# EAGLE schematic module (EAGLE 9.4.0)

## Sheet 1 of 5: Interconnect
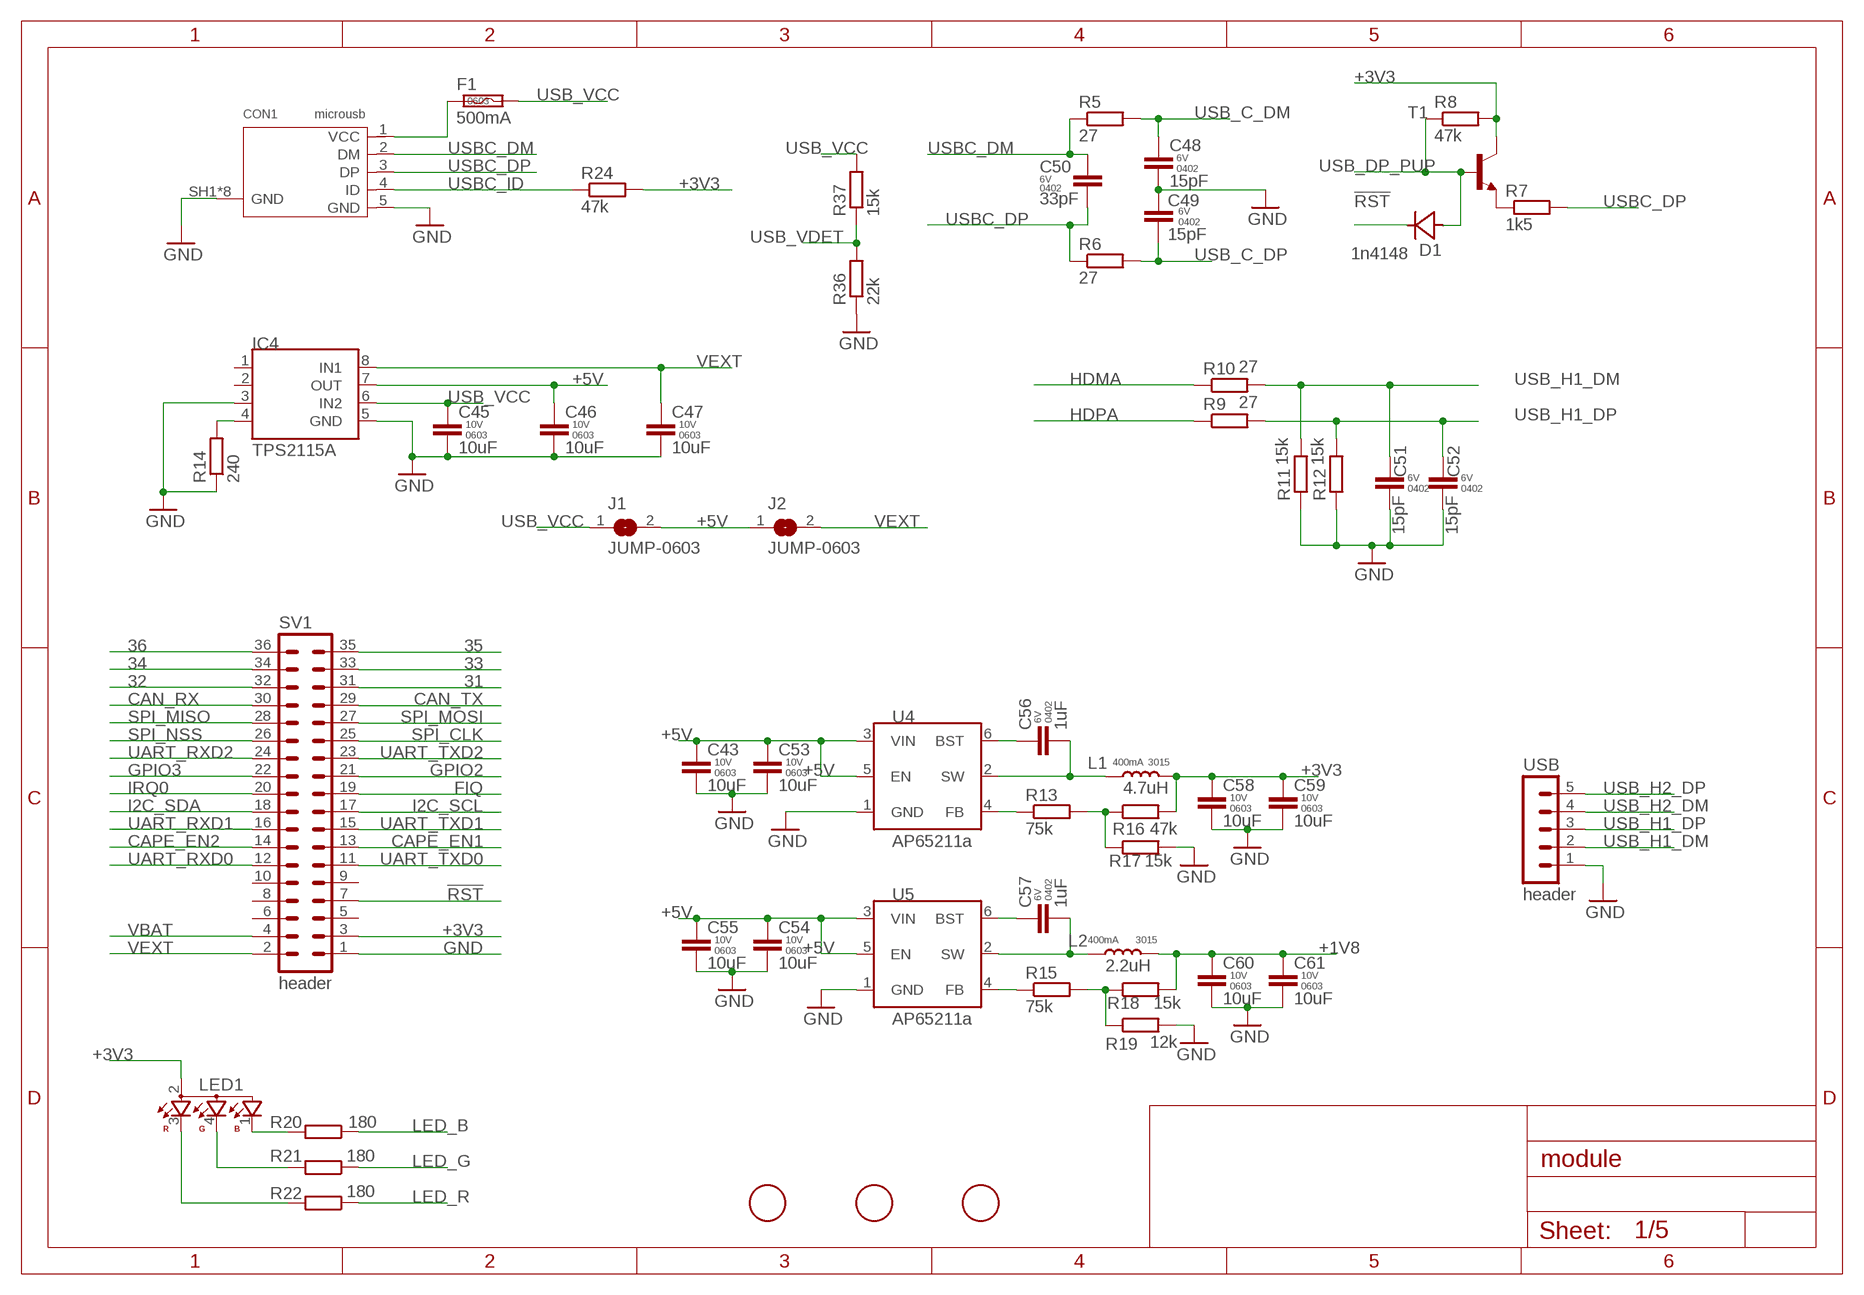
[diagram p0: schematic, sheet 1]

### Parts
C43  10uF  CAP-0603  [C0603]
C45  10uF  CAP-0603  [C0603]
C46  10uF  CAP-0603  [C0603]
C47  10uF  CAP-0603  [C0603]
C48  15pF  CAP-0402  [C0402K]
C49  15pF  CAP-0402  [C0402K]
C50  33pF  CAP-0402  [C0402K]
C51  15pF  CAP-0402  [C0402K]
C52  15pF  CAP-0402  [C0402K]
C53  10uF  CAP-0603  [C0603]
C54  10uF  CAP-0603  [C0603]
C55  10uF  CAP-0603  [C0603]
C56  1uF  CAP-0402  [C0402K]
C57  1uF  CAP-0402  [C0402K]
C58  10uF  CAP-0603  [C0603]
C59  10uF  CAP-0603  [C0603]
C60  10uF  CAP-0603  [C0603]
C61  10uF  CAP-0603  [C0603]
CON1  microusb  10118194-0001LF  [10118194]
D1  1n4148  1N4148WS  [SOD323]
F1  500mA  FUSE-PTC-0603  [F0603]
IC4  TPS2115A  [TSSOP8]
J1  JUMP-0603  [C0603]
J2  JUMP-0603  [C0603]
L1  4.7uH  DJNR3015  [L3230M]
L2  2.2uH  DJNR3015  [L3230M]
LED1  OSTB1204C1E  [321015RGB]
R5  27  R-EU_R0402  [R0402]
R6  27  R-EU_R0402  [R0402]
R7  1k5  R-EU_R0402  [R0402]
R8  47k  R-EU_R0402  [R0402]
R9  27  R-EU_R0402  [R0402]
R10  27  R-EU_R0402  [R0402]
R11  15k  R-EU_R0402  [R0402]
R12  15k  R-EU_R0402  [R0402]
R13  75k  R-EU_R0402  [R0402]
R14  240  R-EU_R0402  [R0402]
R15  75k  R-EU_R0402  [R0402]
R16  47k  R-EU_R0402  [R0402]
R17  15k  R-EU_R0402  [R0402]
R18  15k  R-EU_R0402  [R0402]
R19  12k  R-EU_R0402  [R0402]
R20  180  R-EU_R0402  [R0402]
R21  180  R-EU_R0402  [R0402]
R22  180  R-EU_R0402  [R0402]
R24  47k  R-EU_R0402  [R0402]
R36  22k  R-EU_R0402  [R0402]
R37  15k  R-EU_R0402  [R0402]
SV1  header  MA18-2  [MA18-2]
T1  MMBT2222ALT1-NPN-SOT23-BEC  [SOT23-BEC]
U4  AP65211A  AP65211  [SOT95P280X110-6]
U5  AP65211A  AP65211  [SOT95P280X110-6]
U$1  FIDUCIAL  [FIDUCIAL_1MM]
U$2  FIDUCIAL  [FIDUCIAL_1MM]
U$3  FIDUCIAL  [FIDUCIAL_1MM]
USB  header  MA05-1  [MA05-1]

### Nets
31: SV1.31 ; also sheet 2
32: SV1.32 ; also sheet 2
33: SV1.33 ; also sheet 2
34: SV1.34 ; also sheet 2
35: SV1.35 ; also sheet 2
36: SV1.36 ; also sheet 2
!RST: D1.K(C) SV1.7 ; also sheet 2
+1V8: C60.1 C61.1 L2.2 R18.2 ; also sheet 2
+3V3: C58.1 C59.1 L1.2 LED1.2 R8.2 R16.2 R24.2 SV1.3 T1.C ; also sheet 2,3,5
+5V: C43.1 C46.1 C53.1 C54.1 C55.1 IC4.7(OUT) J1.2 J2.1 U4.3(VIN) U4.5(EN) U5.3(VIN) U5.5(EN)
CAN_RX: SV1.30
CAN_TX: SV1.29
CAPE_EN1: SV1.13 ; also sheet 2
CAPE_EN2: SV1.14 ; also sheet 2
FIQ: SV1.19 ; also sheet 2
GND: C43.2 C45.2 C46.2 C47.2 C48.2 C49.2 C51.2 C52.2 C53.2 C54.2 C55.2 C58.2 C59.2 C60.2 C61.2 CON1.5(GND) CON1.SH1(GND) CON1.SH2(GND) CON1.SH3(GND) CON1.SH4(GND) CON1.SH5(GND) CON1.SH6(GND) CON1.SH7(GND) CON1.SH8(GND) IC4.3 IC4.5(GND) R11.1 R12.1 R14.1 R17.2 R19.2 R36.1 SV1.1 U4.1(GND) U5.1(GND) USB.1 ; also sheet 2,3,5
GPIO2: SV1.21 ; also sheet 2
GPIO3: SV1.22 ; also sheet 2
HDMA: R10.1 ; also sheet 2
HDPA: R9.1 ; also sheet 2
I2C_SCL: SV1.17 ; also sheet 2
I2C_SDA: SV1.18 ; also sheet 2
IRQ0: SV1.20 ; also sheet 2
LED_B: R20.1 ; also sheet 2
LED_G: R21.1 ; also sheet 2
LED_R: R22.1 ; also sheet 2
N$3: C56.2 L1.1 U4.2(SW)
N$4: CON1.1(VCC) F1.1
N$6: IC4.4 R14.2
N$8: C57.2 L2.1 U5.2(SW)
N$9: LED1.1 R20.2
N$10: C56.1 U4.6(BST)
N$11: C57.1 U5.6(BST)
N$14: LED1.4 R21.2
N$15: R15.1 U5.4(FB)
N$18: R7.1 T1.E
N$20: R13.1 U4.4(FB)
N$21: R15.2 R18.1 R19.1
N$22: R13.2 R16.1 R17.1
N$23: LED1.3 R22.2
SPI_CLK: SV1.25 ; also sheet 2
SPI_MISO: SV1.28 ; also sheet 2
SPI_MOSI: SV1.27 ; also sheet 2
SPI_NSS: SV1.26 ; also sheet 2
UART_RXD0: SV1.12 ; also sheet 2
UART_RXD1: SV1.16 ; also sheet 2
UART_RXD2: SV1.24 ; also sheet 2
UART_TXD0: SV1.11 ; also sheet 2
UART_TXD1: SV1.15 ; also sheet 2
UART_TXD2: SV1.23 ; also sheet 2
USB_C_DM: C48.1 R5.2 ; also sheet 2
USB_C_DP: C49.1 R6.2 ; also sheet 2
USB_DP_PUP: D1.A R8.1 T1.B ; also sheet 2
USB_H1_DM: C51.1 R10.2 R11.2 USB.2
USB_H1_DP: C52.1 R9.2 R12.2 USB.3
USB_H2_DM: USB.4
USB_H2_DP: USB.5
USB_VCC: C45.1 F1.2 IC4.6(IN2) J1.1 R37.2
USB_VDET: R36.2 R37.1 ; also sheet 2
USBC_DM: C50.1 CON1.2(DM) R5.1
USBC_DP: C50.2 CON1.3(DP) R6.1 R7.2
USBC_ID: CON1.4(ID) R24.1 ; also sheet 2
VBAT: SV1.4
VEXT: C47.1 IC4.8(IN1) J2.2 SV1.2
Unconnected: IC4.1 IC4.2 SV1.5 SV1.6 SV1.8 SV1.9 SV1.10

## Sheet 2 of 5: Processor
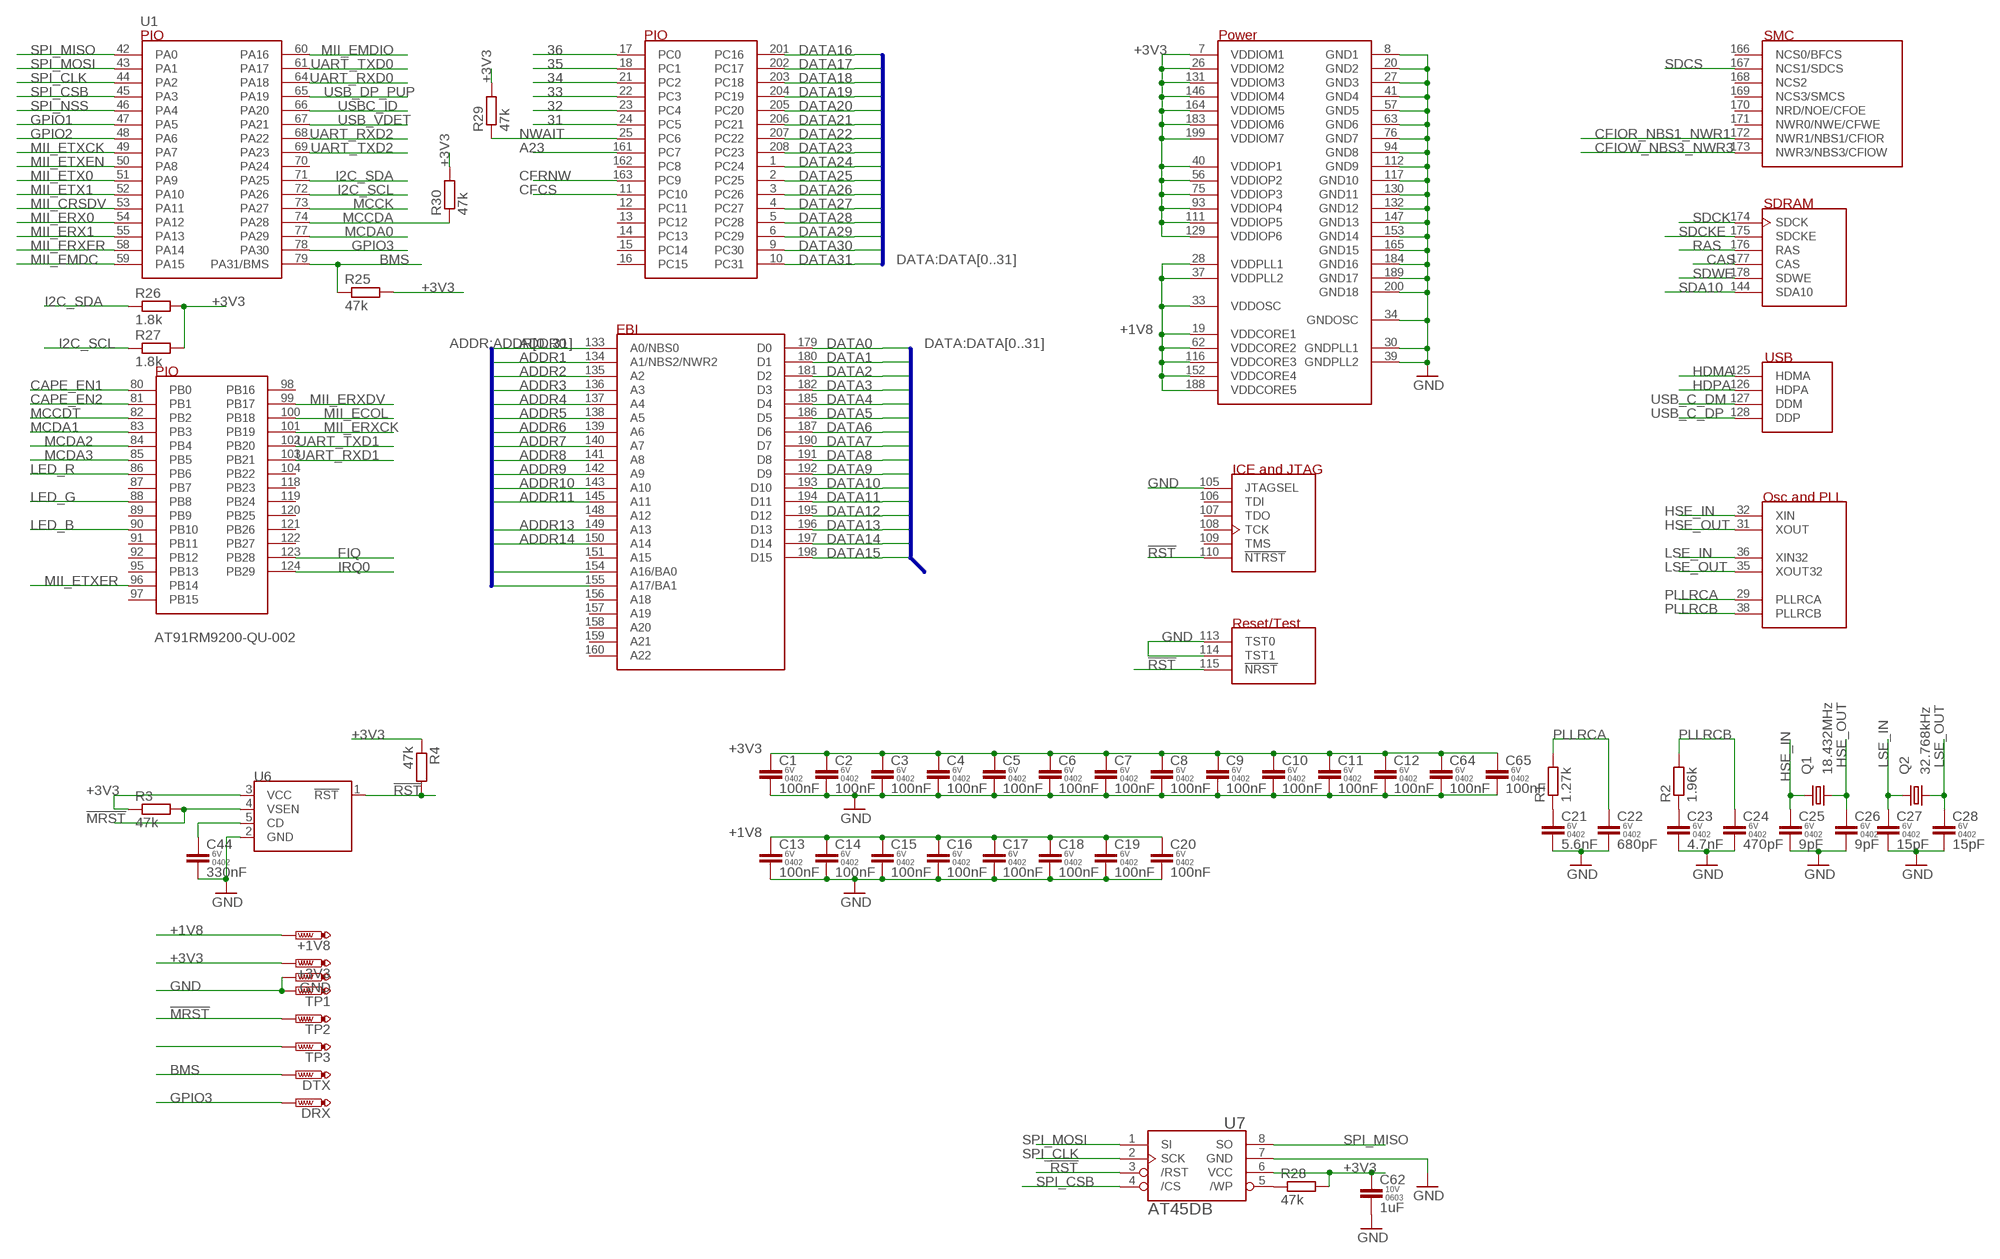
[diagram p1: schematic, sheet 2]

### Parts
+1V8  PTR1B1,27  [B1,27]
+3V3  PTR1B1,27  [B1,27]
C1  100nF  CAP-0402  [C0402K]
C2  100nF  CAP-0402  [C0402K]
C3  100nF  CAP-0402  [C0402K]
C4  100nF  CAP-0402  [C0402K]
C5  100nF  CAP-0402  [C0402K]
C6  100nF  CAP-0402  [C0402K]
C7  100nF  CAP-0402  [C0402K]
C8  100nF  CAP-0402  [C0402K]
C9  100nF  CAP-0402  [C0402K]
C10  100nF  CAP-0402  [C0402K]
C11  100nF  CAP-0402  [C0402K]
C12  100nF  CAP-0402  [C0402K]
C13  100nF  CAP-0402  [C0402K]
C14  100nF  CAP-0402  [C0402K]
C15  100nF  CAP-0402  [C0402K]
C16  100nF  CAP-0402  [C0402K]
C17  100nF  CAP-0402  [C0402K]
C18  100nF  CAP-0402  [C0402K]
C19  100nF  CAP-0402  [C0402K]
C20  100nF  CAP-0402  [C0402K]
C21  5.6nF  CAP-0402  [C0402K]
C22  680pF  CAP-0402  [C0402K]
C23  4.7nF  CAP-0402  [C0402K]
C24  470pF  CAP-0402  [C0402K]
C25  9pF  CAP-0402  [C0402K]
C26  9pF  CAP-0402  [C0402K]
C27  15pF  CAP-0402  [C0402K]
C28  15pF  CAP-0402  [C0402K]
C44  330nF  CAP-0402  [C0402K]
C62  1uF  CAP-0603  [C0603]
C64  100nF  CAP-0402  [C0402K]
C65  100nF  CAP-0402  [C0402K]
DRX  PTR1B1,27  [B1,27]
DTX  PTR1B1,27  [B1,27]
GND  PTR1B1,27  [B1,27]
Q1  18.432MHz  3215-7  [3215]
Q2  32.768kHz  CFPX–217-NHT  [3215]
R1  1.27k  R-EU_R0402  [R0402]
R2  1.96k  R-EU_R0402  [R0402]
R3  47k  R-EU_R0402  [R0402]
R4  47k  R-EU_R0402  [R0402]
R25  47k  R-EU_R0402  [R0402]
R26  1.8k  R-EU_R0402  [R0402]
R27  1.8k  R-EU_R0402  [R0402]
R28  47k  R-EU_R0402  [R0402]
R29  47k  R-EU_R0402  [R0402]
R30  47k  R-EU_R0402  [R0402]
TP1  PTR1B1,27  [B1,27]
TP2  PTR1B1,27  [B1,27]
TP3  PTR1B1,27  [B1,27]
U1  AT91RM9200-QU-002  [QFP50P3120X3120X410-208N]
U6  STM1831  [SOT95P280X100-5]
U7  AT45DB-S  [SO08-208]

### Nets
31: U1.24(PC5) ; also sheet 1
32: U1.23(PC4) ; also sheet 1
33: U1.22(PC3) ; also sheet 1
34: U1.21(PC2) ; also sheet 1
35: U1.18(PC1) ; also sheet 1
36: U1.17(PC0) ; also sheet 1
!MRST: R3.2 TP2.TP U6.4(VSEN)
!RST: R4.2 U1.110(!NTRST) U1.115(!NRST) U6.1(!RST) U7.3(/RST) ; also sheet 1
+1V8: +1V8.TP C13.1 C14.1 C15.1 C16.1 C17.1 C18.1 C19.1 C20.1 U1.19(VDDCORE1) U1.28(VDDPLL1) U1.33(VDDOSC) U1.37(VDDPLL2) U1.62(VDDCORE2) U1.116(VDDCORE3) U1.152(VDDCORE4) U1.188(VDDCORE5) ; also sheet 1
+3V3: +3V3.TP C1.1 C2.1 C3.1 C4.1 C5.1 C6.1 C7.1 C8.1 C9.1 C10.1 C11.1 C12.1 C62.1 C64.1 C65.1 R3.1 R4.1 R25.2 R26.2 R27.2 R28.2 R29.2 R30.2 U1.7(VDDIOM1) U1.26(VDDIOM2) U1.40(VDDIOP1) U1.56(VDDIOP2) U1.75(VDDIOP3) U1.93(VDDIOP4) U1.111(VDDIOP5) U1.129(VDDIOP6) U1.131(VDDIOM3) U1.146(VDDIOM4) U1.164(VDDIOM5) U1.183(VDDIOM6) U1.199(VDDIOM7) U6.3(VCC) U7.6(VCC) ; also sheet 1,3,5
A23: U1.161(PC7)
ADDR0: U1.133(A0/NBS0) ; also sheet 3
ADDR1: U1.134(A1/NBS2/NWR2) ; also sheet 3
ADDR2: U1.135(A2) ; also sheet 3
ADDR3: U1.136(A3) ; also sheet 3
ADDR4: U1.137(A4) ; also sheet 3
ADDR5: U1.138(A5) ; also sheet 3
ADDR6: U1.139(A6) ; also sheet 3
ADDR7: U1.140(A7) ; also sheet 3
ADDR8: U1.141(A8) ; also sheet 3
ADDR9: U1.142(A9) ; also sheet 3
ADDR10: U1.143(A10) ; also sheet 3
ADDR11: U1.145(A11) ; also sheet 3
ADDR13: U1.149(A13) ; also sheet 3
ADDR14: U1.150(A14) ; also sheet 3
ADDR16: U1.154(A16/BA0) ; also sheet 3
ADDR17: U1.155(A17/BA1) ; also sheet 3
BMS: DTX.TP R25.1 U1.79(PA31/BMS)
CAPE_EN1: U1.80(PB0) ; also sheet 1
CAPE_EN2: U1.81(PB1) ; also sheet 1
CAS: U1.177(CAS) ; also sheet 3
CFCS: U1.11(PC10)
CFIOR_NBS1_NWR1: U1.172(NWR1/NBS1/CFIOR) ; also sheet 3
CFIOW_NBS3_NWR3: U1.173(NWR3/NBS3/CFIOW) ; also sheet 3
CFRNW: U1.163(PC9)
DATA0: U1.179(D0) ; also sheet 3
DATA1: U1.180(D1) ; also sheet 3
DATA2: U1.181(D2) ; also sheet 3
DATA3: U1.182(D3) ; also sheet 3
DATA4: U1.185(D4) ; also sheet 3
DATA5: U1.186(D5) ; also sheet 3
DATA6: U1.187(D6) ; also sheet 3
DATA7: U1.190(D7) ; also sheet 3
DATA8: U1.191(D8) ; also sheet 3
DATA9: U1.192(D9) ; also sheet 3
DATA10: U1.193(D10) ; also sheet 3
DATA11: U1.194(D11) ; also sheet 3
DATA12: U1.195(D12) ; also sheet 3
DATA13: U1.196(D13) ; also sheet 3
DATA14: U1.197(D14) ; also sheet 3
DATA15: U1.198(D15) ; also sheet 3
DATA16: U1.201(PC16) ; also sheet 3
DATA17: U1.202(PC17) ; also sheet 3
DATA18: U1.203(PC18) ; also sheet 3
DATA19: U1.204(PC19) ; also sheet 3
DATA20: U1.205(PC20) ; also sheet 3
DATA21: U1.206(PC21) ; also sheet 3
DATA22: U1.207(PC22) ; also sheet 3
DATA23: U1.208(PC23) ; also sheet 3
DATA24: U1.1(PC24) ; also sheet 3
DATA25: U1.2(PC25) ; also sheet 3
DATA26: U1.3(PC26) ; also sheet 3
DATA27: U1.4(PC27) ; also sheet 3
DATA28: U1.5(PC28) ; also sheet 3
DATA29: U1.6(PC29) ; also sheet 3
DATA30: U1.9(PC30) ; also sheet 3
DATA31: U1.10(PC31) ; also sheet 3
FIQ: U1.123(PB28) ; also sheet 1
GND: C1.2 C2.2 C3.2 C4.2 C5.2 C6.2 C7.2 C8.2 C9.2 C10.2 C11.2 C12.2 C13.2 C14.2 C15.2 C16.2 C17.2 C18.2 C19.2 C20.2 C21.2 C22.2 C23.2 C24.2 C25.2 C26.2 C27.2 C28.2 C44.2 C62.2 C64.2 C65.2 GND.TP TP1.TP U1.8(GND1) U1.20(GND2) U1.27(GND3) U1.30(GNDPLL1) U1.34(GNDOSC) U1.39(GNDPLL2) U1.41(GND4) U1.57(GND5) U1.63(GND6) U1.76(GND7) U1.94(GND8) U1.105(JTAGSEL) U1.112(GND9) U1.113(TST0) U1.114(TST1) U1.117(GND10) U1.130(GND11) U1.132(GND12) U1.147(GND13) U1.153(GND14) U1.165(GND15) U1.184(GND16) U1.189(GND17) U1.200(GND18) U6.2(GND) U7.7(GND) ; also sheet 1,3,5
GPIO1: U1.47(PA5)
GPIO2: U1.48(PA6) ; also sheet 1
GPIO3: DRX.TP U1.78(PA30) ; also sheet 1
HDMA: U1.125(HDMA) ; also sheet 1
HDPA: U1.126(HDPA) ; also sheet 1
HSE_IN: C25.1 Q1.1 U1.32(XIN)
HSE_OUT: C26.1 Q1.3 U1.31(XOUT)
I2C_SCL: R27.1 U1.72(PA26) ; also sheet 1
I2C_SDA: R26.1 U1.71(PA25) ; also sheet 1
IRQ0: U1.124(PB29) ; also sheet 1
LED_B: U1.90(PB10) ; also sheet 1
LED_G: U1.88(PB8) ; also sheet 1
LED_R: U1.86(PB6) ; also sheet 1
LSE_IN: C27.1 Q2.1 U1.36(XIN32)
LSE_OUT: C28.1 Q2.2 U1.35(XOUT32)
MCCDA: R30.1 U1.74(PA28) ; also sheet 5
MCCDT: U1.82(PB2) ; also sheet 5
MCCK: U1.73(PA27) ; also sheet 5
MCDA0: U1.77(PA29) ; also sheet 5
MCDA1: U1.83(PB3) ; also sheet 5
MCDA2: U1.84(PB4) ; also sheet 5
MCDA3: U1.85(PB5) ; also sheet 5
MII_CRSDV: U1.53(PA11) ; also sheet 4
MII_ECOL: U1.100(PB18)
MII_EMDC: U1.59(PA15) ; also sheet 4
MII_EMDIO: U1.60(PA16) ; also sheet 4
MII_ERX0: U1.54(PA12) ; also sheet 4
MII_ERX1: U1.55(PA13) ; also sheet 4
MII_ERXCK: U1.101(PB19)
MII_ERXDV: U1.99(PB17)
MII_ERXER: U1.58(PA14) ; also sheet 4
MII_ETX0: U1.51(PA9) ; also sheet 4
MII_ETX1: U1.52(PA10) ; also sheet 4
MII_ETXCK: U1.49(PA7) ; also sheet 4
MII_ETXEN: U1.50(PA8) ; also sheet 4
MII_ETXER: U1.96(PB14)
N$1: C21.1 R1.1
N$2: C23.1 R2.1
N$5: R28.1 U7.5(/WP)
N$12: TP3.TP
N$17: C44.1 U6.5(CD)
NWAIT: R29.1 U1.25(PC6)
PLLRCA: C22.1 R1.2 U1.29(PLLRCA)
PLLRCB: C24.1 R2.2 U1.38(PLLRCB)
RAS: U1.176(RAS) ; also sheet 3
SDA10: U1.144(SDA10) ; also sheet 3
SDCK: U1.174(SDCK) ; also sheet 3
SDCKE: U1.175(SDCKE) ; also sheet 3
SDCS: U1.167(NCS1/SDCS) ; also sheet 3
SDWE: U1.178(SDWE) ; also sheet 3
SPI_CLK: U1.44(PA2) U7.2(SCK) ; also sheet 1
SPI_CSB: U1.45(PA3) U7.4(/CS)
SPI_MISO: U1.42(PA0) U7.8(SO) ; also sheet 1
SPI_MOSI: U1.43(PA1) U7.1(SI) ; also sheet 1
SPI_NSS: U1.46(PA4) ; also sheet 1
UART_RXD0: U1.64(PA18) ; also sheet 1
UART_RXD1: U1.103(PB21) ; also sheet 1
UART_RXD2: U1.68(PA22) ; also sheet 1
UART_TXD0: U1.61(PA17) ; also sheet 1
UART_TXD1: U1.102(PB20) ; also sheet 1
UART_TXD2: U1.69(PA23) ; also sheet 1
USB_C_DM: U1.127(DDM) ; also sheet 1
USB_C_DP: U1.128(DDP) ; also sheet 1
USB_DP_PUP: U1.65(PA19) ; also sheet 1
USB_VDET: U1.67(PA21) ; also sheet 1
USBC_ID: U1.66(PA20) ; also sheet 1
Unconnected: U1.12(PC11) U1.13(PC12) U1.14(PC13) U1.15(PC14) U1.16(PC15) U1.70(PA24) U1.87(PB7) U1.89(PB9) U1.91(PB11) U1.92(PB12) U1.95(PB13) U1.97(PB15) U1.98(PB16) U1.104(PB22) U1.106(TDI) U1.107(TDO) U1.108(TCK) U1.109(TMS) U1.118(PB23) U1.119(PB24) U1.120(PB25) U1.121(PB26) U1.122(PB27) U1.148(A12) U1.151(A15) U1.156(A18) U1.157(A19) U1.158(A20) U1.159(A21) U1.160(A22) U1.162(PC8) U1.166(NCS0/BFCS) U1.168(NCS2) U1.169(NCS3/SMCS) U1.170(NRD/NOE/CFOE) U1.171(NWR0/NWE/CFWE)

### Buses
ADDR:ADDR[0..31]
DATA:DATA[0..31]

## Sheet 3 of 5: SDRAM
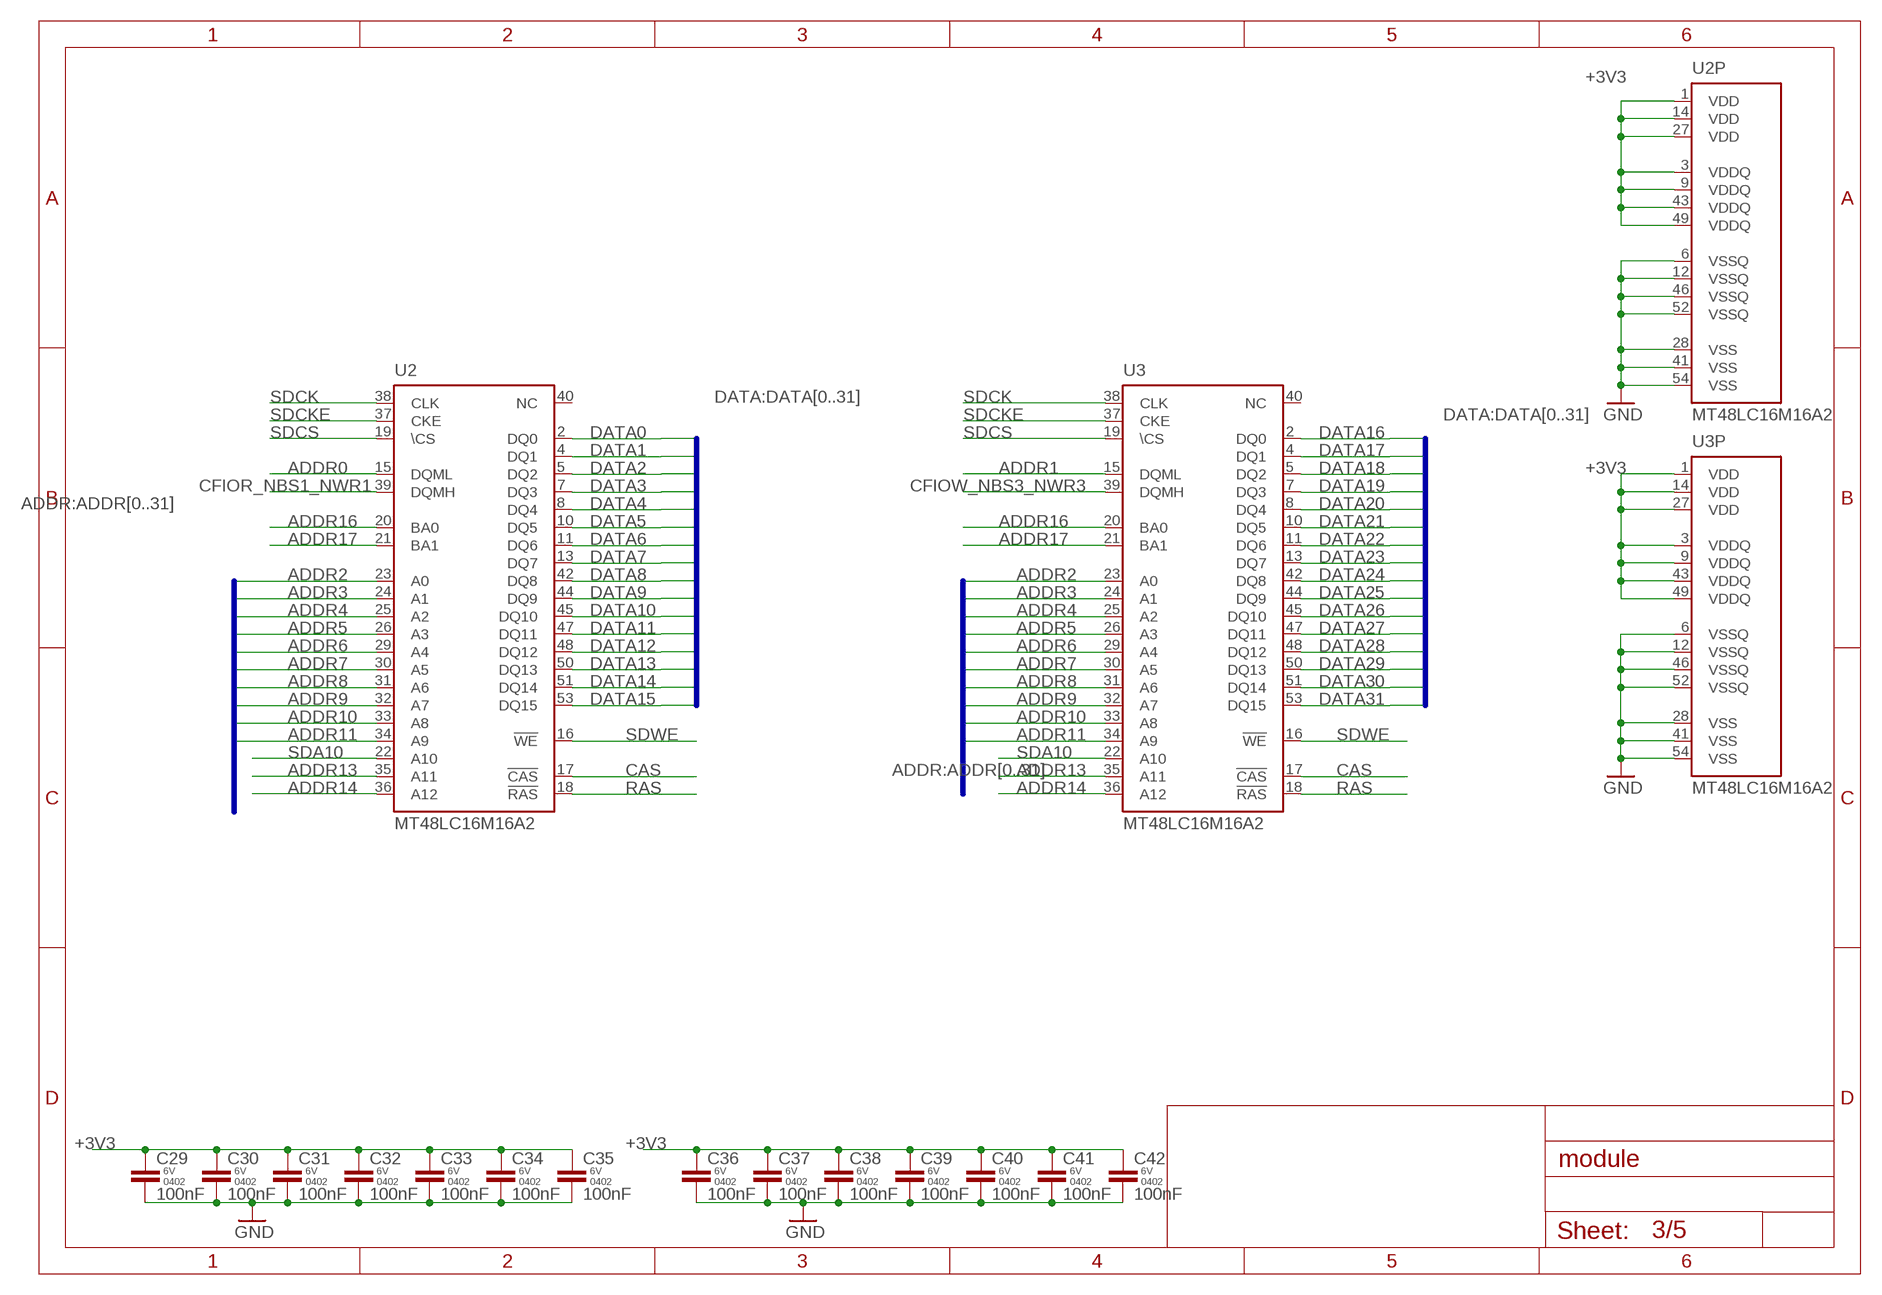
[diagram p2: schematic, sheet 3]

### Parts
C29  100nF  CAP-0402  [C0402K]
C30  100nF  CAP-0402  [C0402K]
C31  100nF  CAP-0402  [C0402K]
C32  100nF  CAP-0402  [C0402K]
C33  100nF  CAP-0402  [C0402K]
C34  100nF  CAP-0402  [C0402K]
C35  100nF  CAP-0402  [C0402K]
C36  100nF  CAP-0402  [C0402K]
C37  100nF  CAP-0402  [C0402K]
C38  100nF  CAP-0402  [C0402K]
C39  100nF  CAP-0402  [C0402K]
C40  100nF  CAP-0402  [C0402K]
C41  100nF  CAP-0402  [C0402K]
C42  100nF  CAP-0402  [C0402K]
U2  MT48LC16M16A2  [TSOP54-400]
U3  MT48LC16M16A2  [TSOP54-400]

### Nets
+3V3: C29.1 C30.1 C31.1 C32.1 C33.1 C34.1 C35.1 C36.1 C37.1 C38.1 C39.1 C40.1 C41.1 C42.1 U2.1(VDD) U2.3(VDDQ) U2.9(VDDQ) U2.14(VDD) U2.27(VDD) U2.43(VDDQ) U2.49(VDDQ) U3.1(VDD) U3.3(VDDQ) U3.9(VDDQ) U3.14(VDD) U3.27(VDD) U3.43(VDDQ) U3.49(VDDQ) ; also sheet 1,2,5
ADDR0: U2.15(DQML) ; also sheet 2
ADDR1: U3.15(DQML) ; also sheet 2
ADDR2: U2.23(A0) U3.23(A0) ; also sheet 2
ADDR3: U2.24(A1) U3.24(A1) ; also sheet 2
ADDR4: U2.25(A2) U3.25(A2) ; also sheet 2
ADDR5: U2.26(A3) U3.26(A3) ; also sheet 2
ADDR6: U2.29(A4) U3.29(A4) ; also sheet 2
ADDR7: U2.30(A5) U3.30(A5) ; also sheet 2
ADDR8: U2.31(A6) U3.31(A6) ; also sheet 2
ADDR9: U2.32(A7) U3.32(A7) ; also sheet 2
ADDR10: U2.33(A8) U3.33(A8) ; also sheet 2
ADDR11: U2.34(A9) U3.34(A9) ; also sheet 2
ADDR13: U2.35(A11) U3.35(A11) ; also sheet 2
ADDR14: U2.36(A12) U3.36(A12) ; also sheet 2
ADDR16: U2.20(BA0) U3.20(BA0) ; also sheet 2
ADDR17: U2.21(BA1) U3.21(BA1) ; also sheet 2
CAS: U2.17(!CAS) U3.17(!CAS) ; also sheet 2
CFIOR_NBS1_NWR1: U2.39(DQMH) ; also sheet 2
CFIOW_NBS3_NWR3: U3.39(DQMH) ; also sheet 2
DATA0: U2.2(DQ0) ; also sheet 2
DATA1: U2.4(DQ1) ; also sheet 2
DATA2: U2.5(DQ2) ; also sheet 2
DATA3: U2.7(DQ3) ; also sheet 2
DATA4: U2.8(DQ4) ; also sheet 2
DATA5: U2.10(DQ5) ; also sheet 2
DATA6: U2.11(DQ6) ; also sheet 2
DATA7: U2.13(DQ7) ; also sheet 2
DATA8: U2.42(DQ8) ; also sheet 2
DATA9: U2.44(DQ9) ; also sheet 2
DATA10: U2.45(DQ10) ; also sheet 2
DATA11: U2.47(DQ11) ; also sheet 2
DATA12: U2.48(DQ12) ; also sheet 2
DATA13: U2.50(DQ13) ; also sheet 2
DATA14: U2.51(DQ14) ; also sheet 2
DATA15: U2.53(DQ15) ; also sheet 2
DATA16: U3.2(DQ0) ; also sheet 2
DATA17: U3.4(DQ1) ; also sheet 2
DATA18: U3.5(DQ2) ; also sheet 2
DATA19: U3.7(DQ3) ; also sheet 2
DATA20: U3.8(DQ4) ; also sheet 2
DATA21: U3.10(DQ5) ; also sheet 2
DATA22: U3.11(DQ6) ; also sheet 2
DATA23: U3.13(DQ7) ; also sheet 2
DATA24: U3.42(DQ8) ; also sheet 2
DATA25: U3.44(DQ9) ; also sheet 2
DATA26: U3.45(DQ10) ; also sheet 2
DATA27: U3.47(DQ11) ; also sheet 2
DATA28: U3.48(DQ12) ; also sheet 2
DATA29: U3.50(DQ13) ; also sheet 2
DATA30: U3.51(DQ14) ; also sheet 2
DATA31: U3.53(DQ15) ; also sheet 2
GND: C29.2 C30.2 C31.2 C32.2 C33.2 C34.2 C35.2 C36.2 C37.2 C38.2 C39.2 C40.2 C41.2 C42.2 U2.6(VSSQ) U2.12(VSSQ) U2.28(VSS) U2.41(VSS) U2.46(VSSQ) U2.52(VSSQ) U2.54(VSS) U3.6(VSSQ) U3.12(VSSQ) U3.28(VSS) U3.41(VSS) U3.46(VSSQ) U3.52(VSSQ) U3.54(VSS) ; also sheet 1,2,5
RAS: U2.18(!RAS) U3.18(!RAS) ; also sheet 2
SDA10: U2.22(A10) U3.22(A10) ; also sheet 2
SDCK: U2.38(CLK) U3.38(CLK) ; also sheet 2
SDCKE: U2.37(CKE) U3.37(CKE) ; also sheet 2
SDCS: U2.19(\CS) U3.19(\CS) ; also sheet 2
SDWE: U2.16(!WE) U3.16(!WE) ; also sheet 2
Unconnected: U2.40(NC) U3.40(NC)

### Buses
DATA:DATA[0..31]
ADDR:ADDR[0..31]

## Sheet 4 of 5: Ethernet
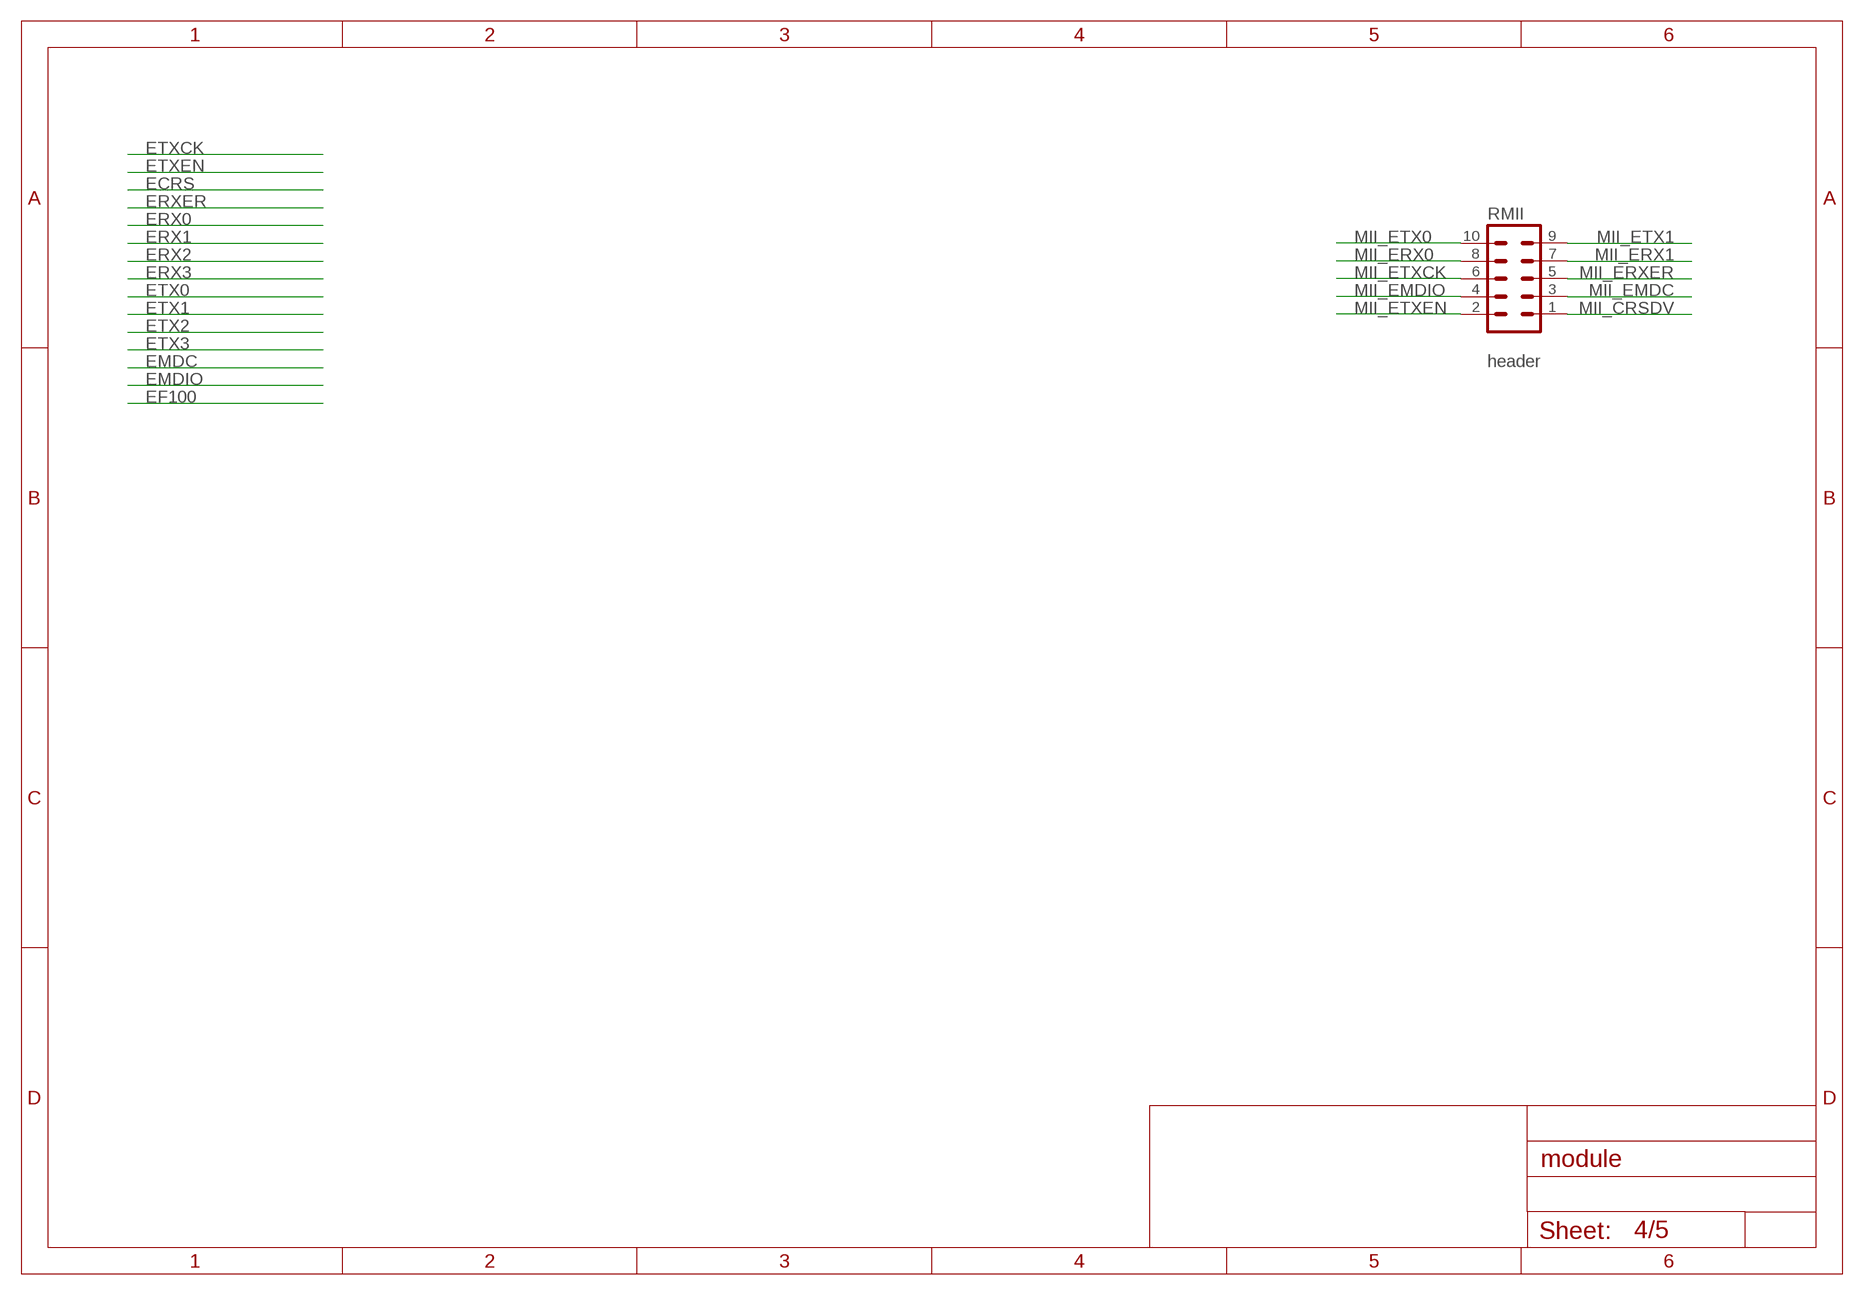
[diagram p3: schematic, sheet 4]

### Parts
RMII  header  MA05-2  [MA05-2]

### Nets
MII_CRSDV: RMII.1 ; also sheet 2
MII_EMDC: RMII.3 ; also sheet 2
MII_EMDIO: RMII.4 ; also sheet 2
MII_ERX0: RMII.8 ; also sheet 2
MII_ERX1: RMII.7 ; also sheet 2
MII_ERXER: RMII.5 ; also sheet 2
MII_ETX0: RMII.10 ; also sheet 2
MII_ETX1: RMII.9 ; also sheet 2
MII_ETXCK: RMII.6 ; also sheet 2
MII_ETXEN: RMII.2 ; also sheet 2

## Sheet 5 of 5: SD Card
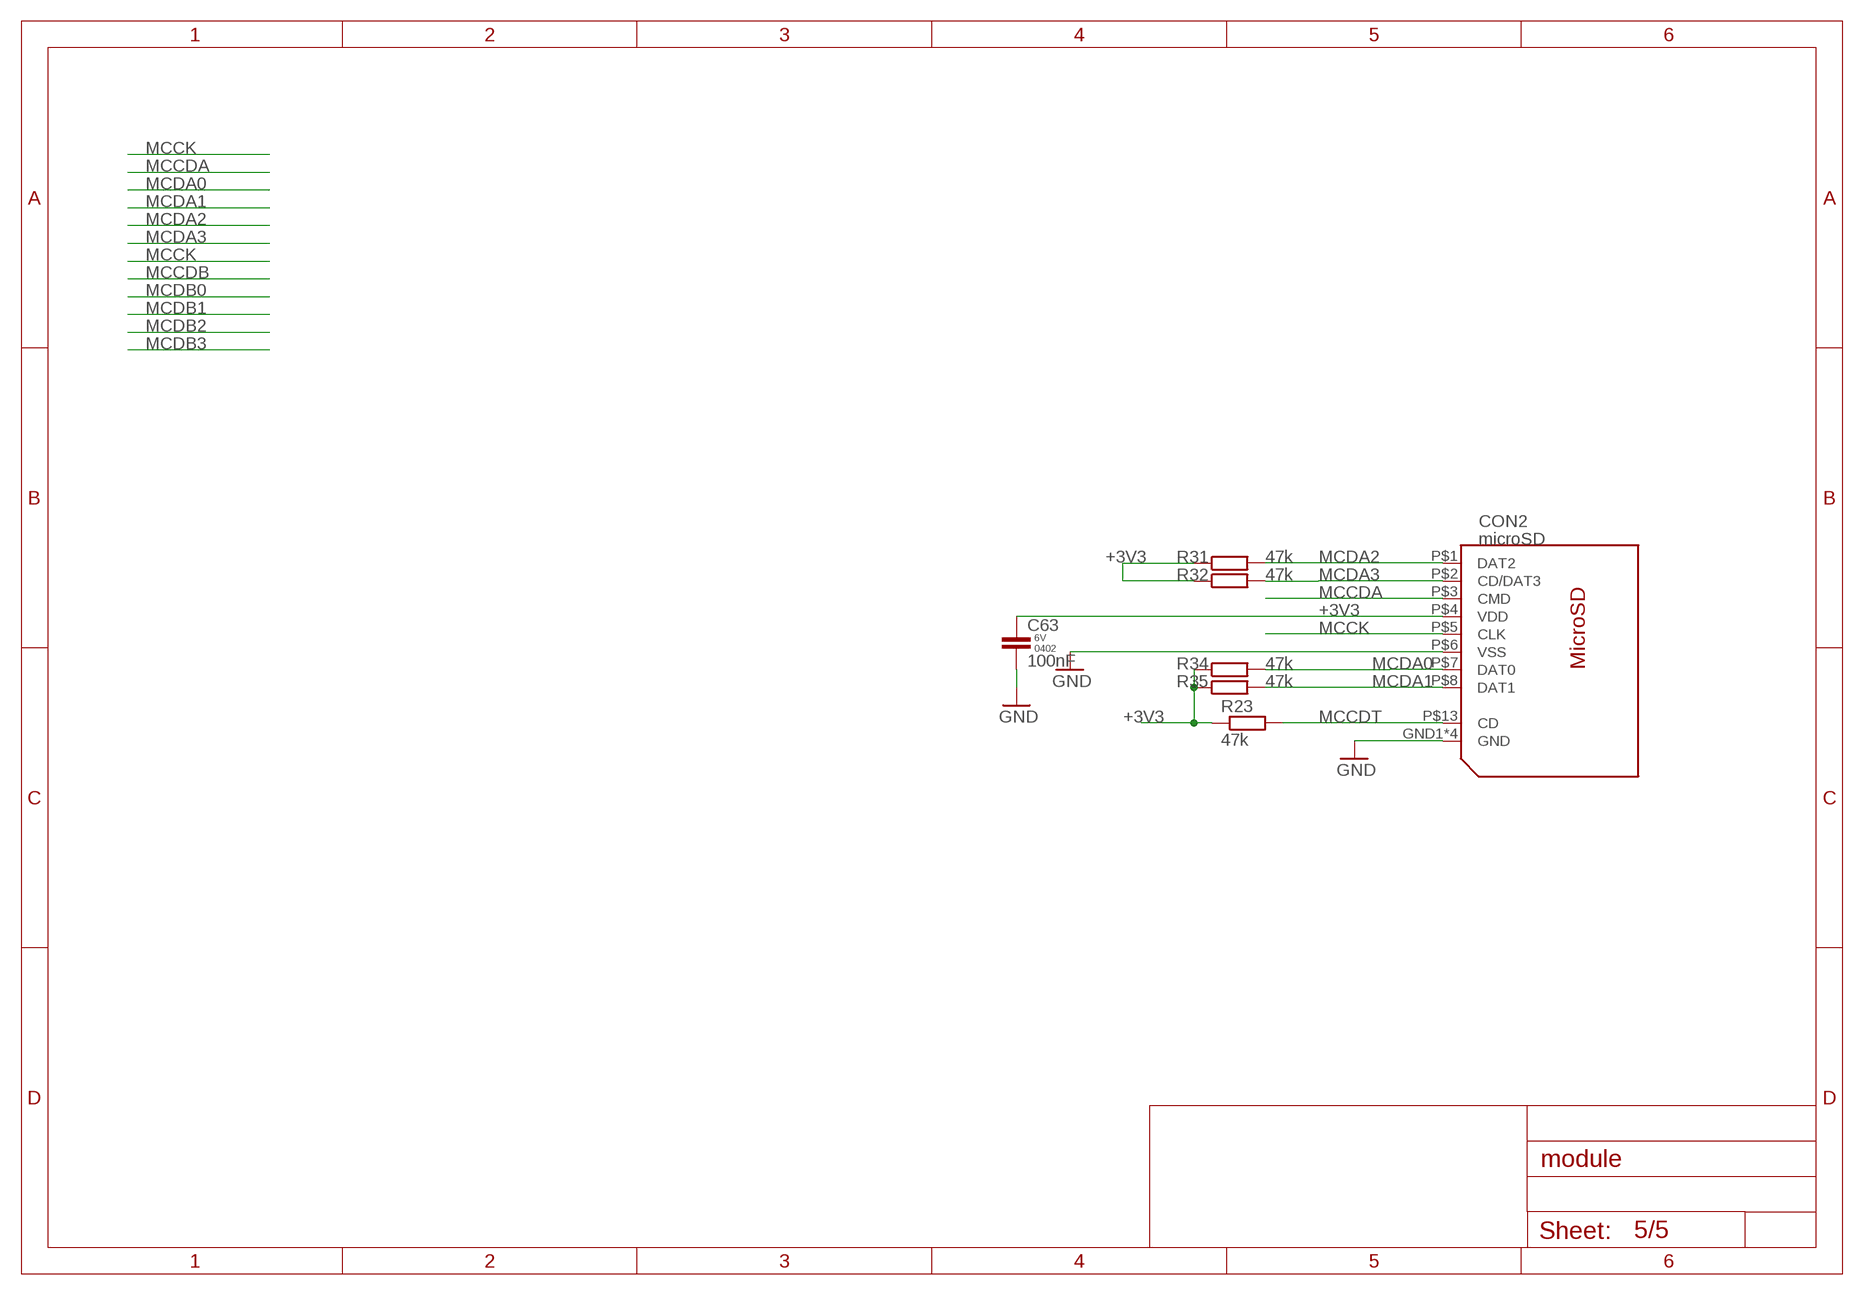
[diagram p4: schematic, sheet 5]

### Parts
C63  100nF  CAP-0402  [C0402K]
CON2  microSD  112J-TXAR  [112J]
R23  47k  R-EU_R0402  [R0402]
R31  47k  R-EU_R0402  [R0402]
R32  47k  R-EU_R0402  [R0402]
R34  47k  R-EU_R0402  [R0402]
R35  47k  R-EU_R0402  [R0402]

### Nets
+3V3: C63.1 CON2.P$4(VDD) R23.1 R31.1 R32.1 R34.1 R35.1 ; also sheet 1,2,3
GND: C63.2 CON2.GND1(GND) CON2.GND2(GND) CON2.GND3(GND) CON2.GND4(GND) CON2.P$6(VSS) ; also sheet 1,2,3
MCCDA: CON2.P$3(CMD) ; also sheet 2
MCCDT: CON2.P$13(CD) R23.2 ; also sheet 2
MCCK: CON2.P$5(CLK) ; also sheet 2
MCDA0: CON2.P$7(DAT0) R34.2 ; also sheet 2
MCDA1: CON2.P$8(DAT1) R35.2 ; also sheet 2
MCDA2: CON2.P$1(DAT2) R31.2 ; also sheet 2
MCDA3: CON2.P$2(CD/DAT3) R32.2 ; also sheet 2

## Library data of the parts
+1V8 +3V3 DRX DTX GND TP1-TP3 = testpad:PTR1: TEST PIN
C1-C42 C44 C48-C52 C56 C57 C63-C65 = parts-passives:CAP-; PACKAGE: 0402; RATING: 6V
C43 C45-C47 C53-C55 C58-C62 = parts-passives:CAP-; PACKAGE: 0603; RATING: 10V
CON1 = parts-amphenol:10118194-00
CON2 = parts-attend:112J-TXAR
D1 = parts-diotec:1N4148WS
F1 = parts-passives:FUSE-PTC-; CURRENT: 0.6A; PACKAGE: 0603
IC4 = parts-ti:TPS211
J1 J2 = parts-helpers:JUMP-
L1 L2 = parts-ferrocore:DJNR3015; CURRENT: 400mA; PACKAGE: 3015
LED1 = parts-optosupply:OSTB1204
Q1 = parts-srpassives:3215: SMD Crystal 3.2x2.5
Q2 = parts-iqd:CFPX–217: 32.768
R1-R32 R34-R37 = rcl:R-EU_: RESISTOR, European symbol; SPICEPREFIX: R
RMII = parts-passives:MA05-2: PIN HEADER; OC_FARNELL: unknown; OC_NEWARK: unknown
SV1 = parts-passives:MA18-2: PIN HEADER; OC_FARNELL: unknown; OC_NEWARK: unknown
T1 = transistor:*-NPN-: NPN Transistror BF959 corrected 2008.03.06
U1 = parts-microchip:AT91RM9200-QU-002: AT91 Series 180 MHz 128 kB Flash 48 kB SRAM 32-Bit Microcontroller - PQFP-208; AVAILABILITY: Unavailable; DESCRIPTION: AT91 Series 180 MHz 128 kB Flash 48 kB SRAM 32-Bit Microcontroller - PQFP-208; MF: Microchip; MP: AT91RM9200-QU-002; PACKAGE: PQFP-208 Microchip; PRICE: None
U2 U3 = parts-alliance_mem:MT48LC16M16A2: 256Mb: x16 SDRAM MT48LC16M16A2 - 4 Meg x 16 x 4 banks Source: http://download.micron.com/pdf/datasheets/dram/sdram/256MSDRAM.pdf; OC_FARNELL: unknown; OC_NEWARK: unknown
U4 U5 = parts-diodes:AP65211
U6 = parts-st:STM1831: The STM1831 is a voltage detector with very low current consumption. It monitors a voltage on a separate input pin (VSEN), which is fully functional even if the monitored voltage goes down to 0 V. In addition, the delay of the output can be adjusted by an external capacitor
U7 = parts-adesto:AT45DB
U$1-U$3 = adafruit:FIDUCIAL: For use by pick and place machines to calibrate the vision/machine, 1mm By microbuilder.eu
USB = parts-passives:MA05-1: PIN HEADER; OC_FARNELL: unknown; OC_NEWARK: unknown